# Altium schematic sheet Sheet4.SchDoc
size OrCAD A
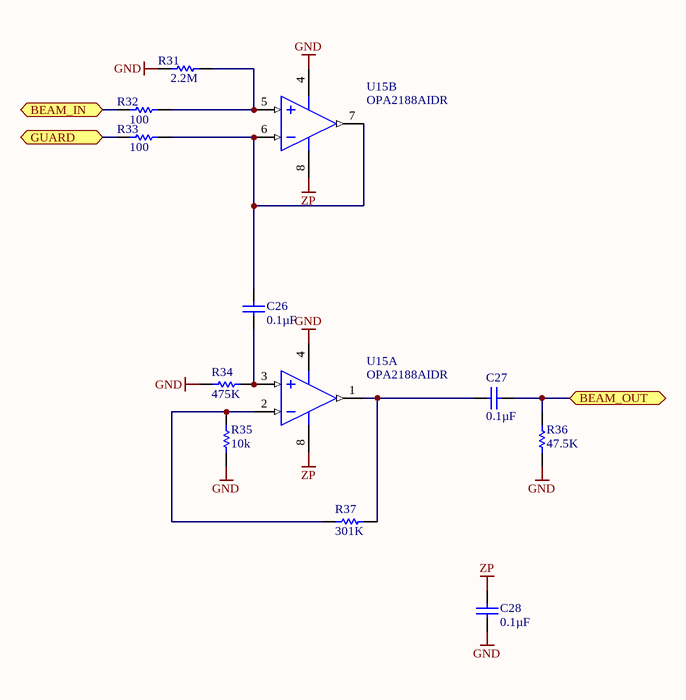
[diagram p0: Sheet4.SchDoc]

## Parts
C26  Capacitance: 0.1µF  [CAPC0805(2012)145_N]  (hidden comment: CAP CER 0.1UF 25V X7R 0805)
C27  Capacitance: 0.1µF  [CAPC0805(2012)145_N]  (hidden comment: CAP CER 0.1UF 25V X7R 0805)
C28  Capacitance: 0.1µF  [CAPC0805(2012)145_N]  (hidden comment: CAP CER 0.1UF 25V X7R 0805)
R31  2.2M  [RESC0402(1005)_M]
R32  100  [RESC0402(1005)_M]
R33  100  [RESC0402(1005)_M]
R34  475K  [RESC0402(1005)_M]
R35  10k  [RESC0402(1005)_M]
R36  47.5K  [RESC0402(1005)_M]
R37  301K  [RESC0402(1005)_M]
U15  OPA2188AIDR  [D0008A_L]  (parts A,B of 2)

## Ports
BEAM_IN, BEAM_OUT, GUARD

## Nets
GND: C28.1 R31.2 R34.2 R35.2 R36.2 U15.4(V-)
ZP: C28.2 U15.8(V+)
BEAM_IN: R32.2 ; port BEAM_IN
BEAM_OUT: C27.1 R36.1 ; port BEAM_OUT
GUARD: R33.2 ; port GUARD
NetC26_1: C26.1 R33.1 U15.6(IN_B-) U15.7(OUT_B)
NetC26_2: C26.2 R34.1 U15.3(IN_A+)
NetC27_2: C27.2 R37.1 U15.1(OUT_A)
NetR31_1: R31.1 R32.1 U15.5(IN_B+)
NetR35_1: R35.1 R37.2 U15.2(IN_A-)

## Notes on the sheet
- Title
- Size:
- Date:
- Orcad A
- Number:
- Time:
- Revision:
- Sheet
- of
- ZLS Corporation
- 7801 North Lamar Blvd.
- Suite E-184
- Austin, Texas 78752  USA
- (512) 453-0288
- File:

## Library data of the parts
C26-C28 = CMP-1036-04795-1: Manufacturer: Murata Electronics North America; Manufacturer Part Number: GRM21BR71E104KA01L; Tolerance: ±10%; Supplier 1: Digi-Key; Supplier Part Number 1: 490-1673-6-ND; RoHS: RoHS Compliant; Category: Capacitors; Stock 1: 891652; Pricing 1: 1=0.2, 10=0.145, 100=0.0683, 500=0.04788, 1000=0.03964 (USD); Packaging: Digi-Reel®; Part Status: Active; Voltage - Rated: 25V; Temperature Coefficient: X7R; Operating Temperature: -55°C ~ 125°C; Features: -; Ratings: -; Applications: General Purpose; Mounting Type: Surface Mount, MLCC; Package / Case: 0805 (2012 Metric); Size / Dimension: 0.079" L x 0.049" W (2.00mm x 1.25mm); Height - Seated (Max): -; Thickness (Max): 0.053" (1.35mm); Lead Spacing: -; Lead Style: -; ComponentLink1URL: http://www.murata.com/~/media/webrenewal/support/library/catalog/products/capacitor/mlcc/c02e.ashx; ComponentLink1Description: http://www.murata.com/~/media/webrenewal/support/library/catalog/products/capacitor/mlcc/c02e.ashx
R31-R37 = CMP-1011-00651-1: RES SMD 10K OHM 1% 1/8W 0402; Manufacturer: Vishay Dale; Manufacturer Part Number: CRCW0402100KFKEDHP; Supplier Part Number 1: CRCW0402100KFKEDHP/BKN; Case/Package: 0402; Case Code (Metric): 1005; Case Code (Imperial): 0402; Contact Plating: Tin; Composition: Thick Film; Length: 1mm; Height: 0.3mm; Depth: 0.5mm; Lead Free: Lead Free; ComponentLink1URL: https://datasheet.ciiva.com/8982/crcwhpe3-8982553.pdf; ComponentLink1Description: https://datasheet.ciiva.com/8982/crcwhpe3-8982553.pdf; ComponentLink2URL: https://datasheet.ciiva.com/2498/crcwhpe3-2498716.pdf; ComponentLink2Description: https://datasheet.ciiva.com/2498/crcwhpe3-2498716.pdf; ComponentLink3URL: https://datasheet.ciiva.com/2498/crcwhpe3-2498717.pdf; ComponentLink3Description: https://datasheet.ciiva.com/2498/crcwhpe3-2498717.pdf; ComponentLink4URL: https://datasheet.ciiva.com/5548/crcwhpe3-46056-5548557.pdf; ComponentLink4Description: https://datasheet.ciiva.com/5548/crcwhpe3-46056-5548557.pdf; ComponentLink5URL: https://datasheet.ciiva.com/2498/crcwhpe3-2498718.pdf; ComponentLink5Description: https://datasheet.ciiva.com/2498/crcwhpe3-2498718.pdf; ComponentLink6URL: https://datasheet.ciiva.com/48525/crcwhpe3-48525582.pdf; ComponentLink6Description: https://datasheet.ciiva.com/48525/crcwhpe3-48525582.pdf; ComponentLink7URL: https://datasheet.ciiva.com/46441/1703058-46441599.pdf; ComponentLink7Description: https://datasheet.ciiva.com/46441/1703058-46441599.pdf
U15 = CMP-0272-00241-3: 0.03 uV/degC, 6 uV Vos, Low Noise, Rail-to-Rail Output, Zero-Drift Operational Amplifier, 4 to 36 V, -40 to 105 degC, 8-pin SOIC (D8), Green (RoHS & no Sb/Br); Manufacturer: Texas Instruments; Number of Circuits: 2; Slew Rate: 0.8 V/µs; Current - Supply: 415µA; Current - Output / Channel: 18mA; Voltage - Supply, Single/Dual (±): 4 V ~ 36 V, ±2 V ~ 18 V; Supplier 1: Digi-Key; Supplier Part Number 1: 296-29454-6-ND; Manufacturer Part Number: OPA2188AIDR; RoHS: RoHS Compliant; Category: Integrated Circuits (ICs); Stock 1: 8272; Pricing 1: 1=3.44, 10=3.089, 100=2.5307, 500=2.15434, 1000=1.81692 (USD); Packaging: Digi-Reel®; Part Status: Active; Amplifier Type: Zero-Drift; Output Type: Rail-to-Rail; -3db Bandwidth: -; Operating Temperature: -40°C ~ 105°C; Mounting Type: Surface Mount; Package / Case: 8-SOIC (0.154", 3.90mm Width); Supplier Device Package: 8-SOIC; ComponentLink1URL: http://www.ti.com/lit/ds/symlink/opa2188.pdf; ComponentLink1Description: http://www.ti.com/lit/ds/symlink/opa2188.pdf